# Altium schematic sheet HOST_PORT-USB2.0.SchDoc
size C
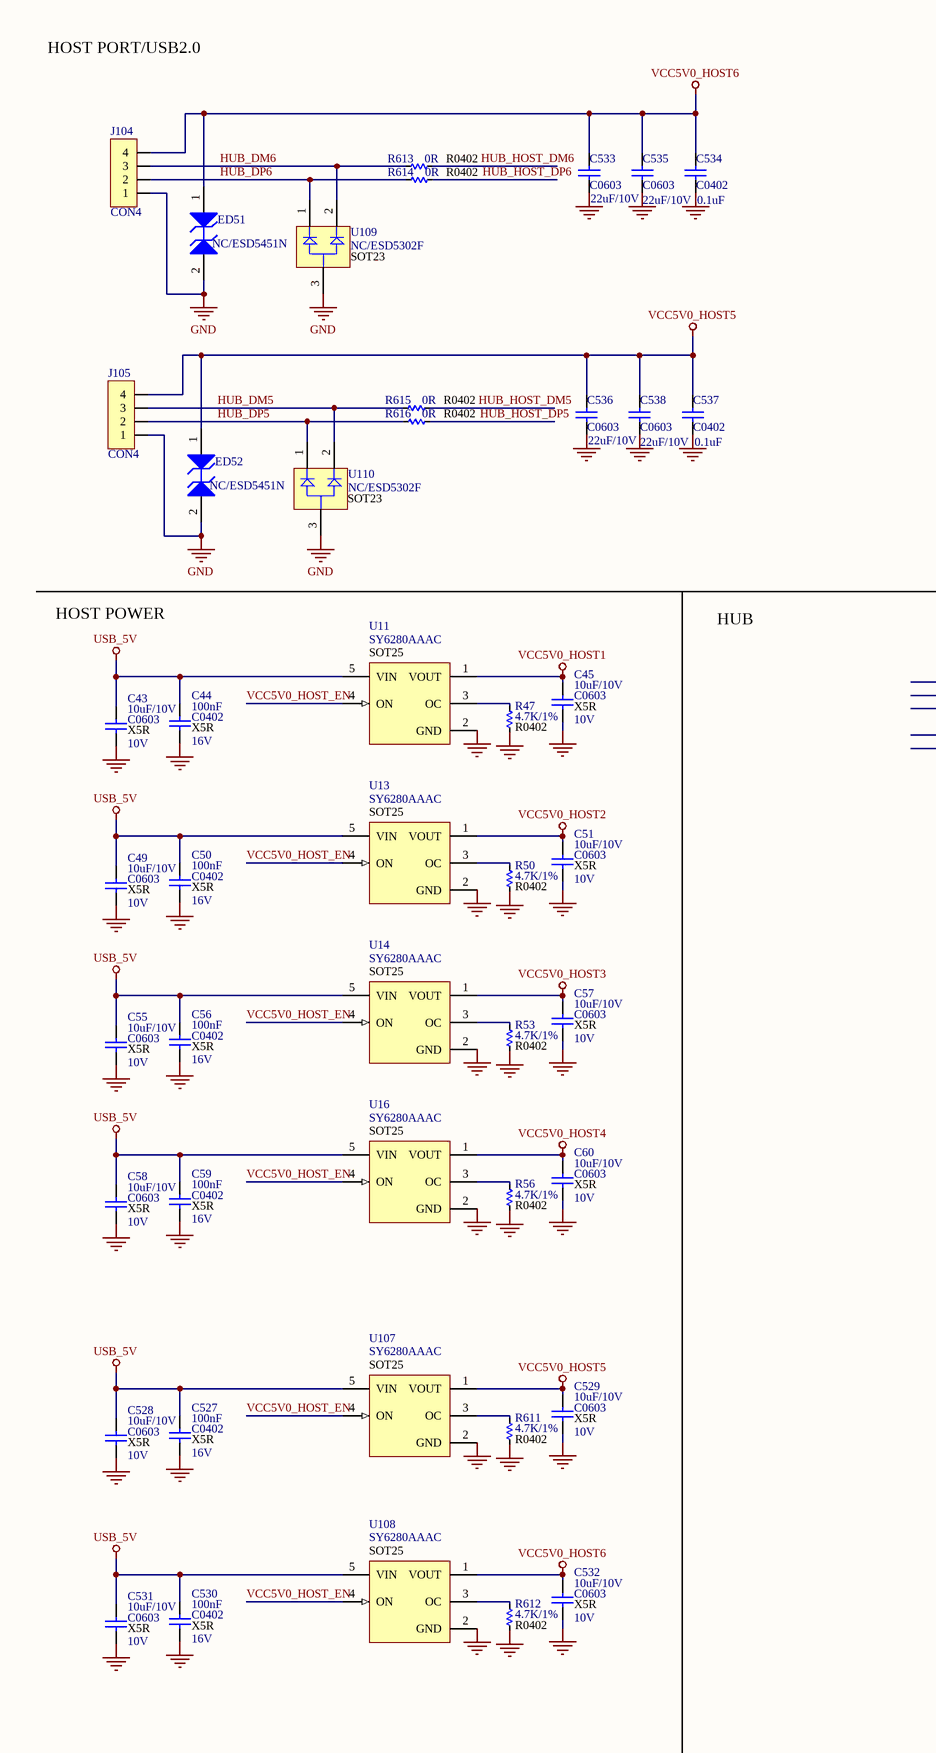
[diagram p0: HOST_PORT-USB2.0.SchDoc, left]
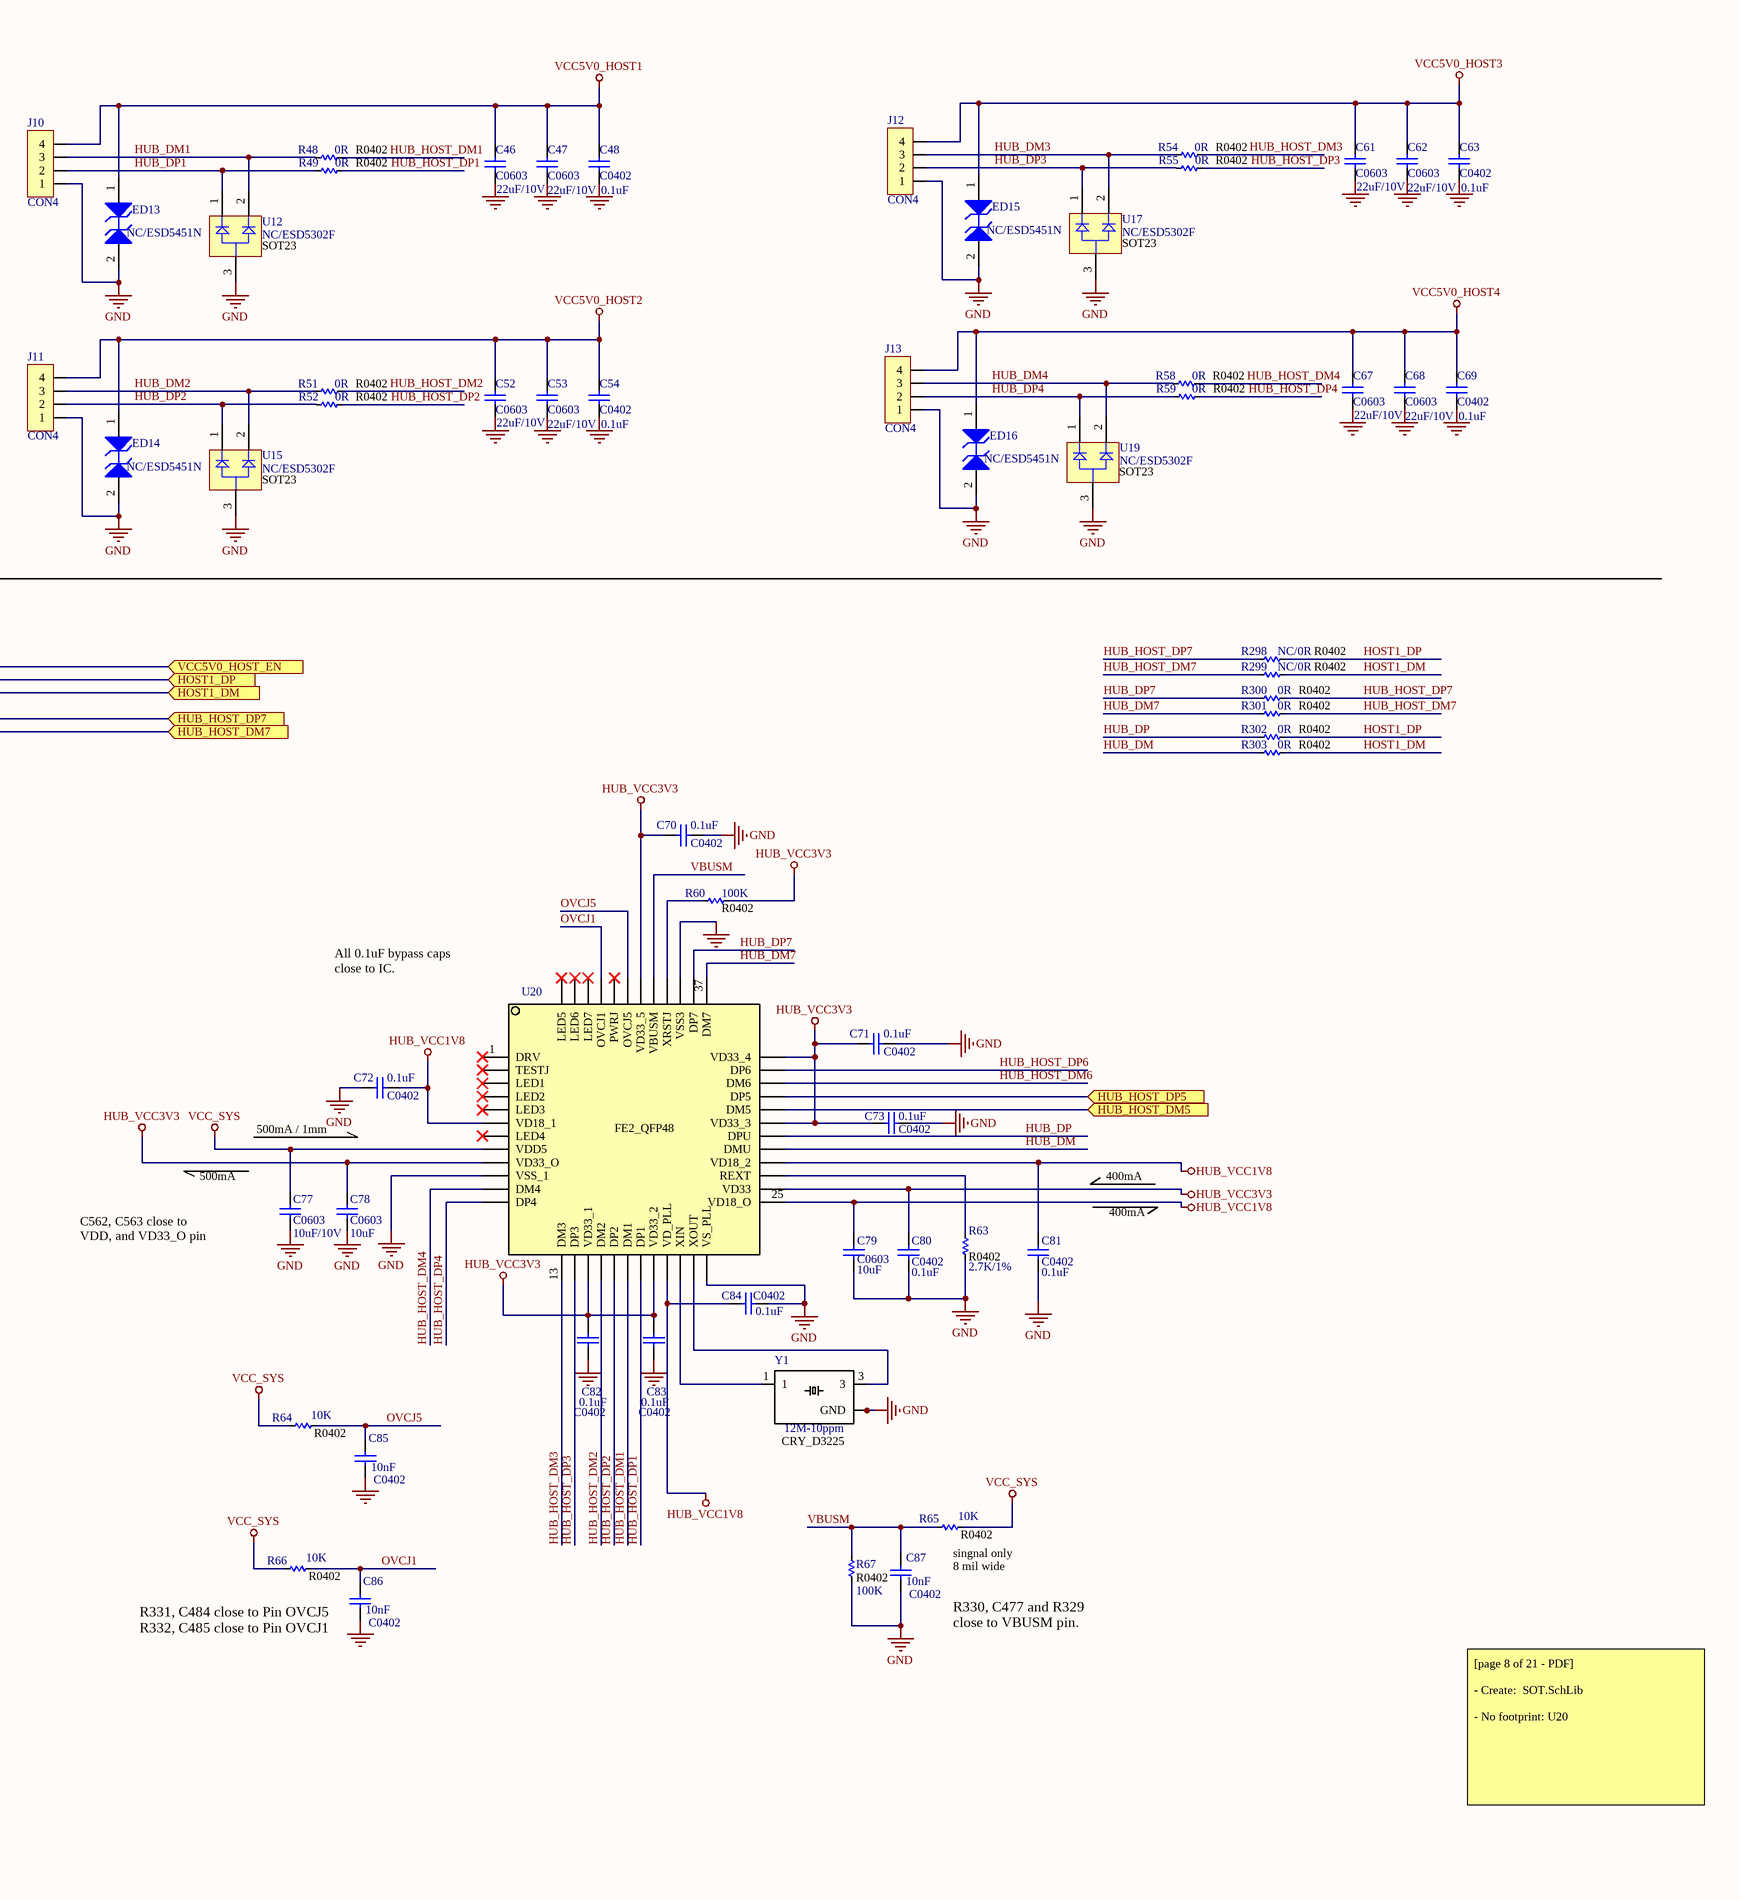
[diagram p1: HOST_PORT-USB2.0.SchDoc, right]

## Parts
C43  C0603  value 10uF/10V  [C 0603]
C44  C0402  value 100nF  [C 0402]
C45  C0603  value 10uF/10V  [C 0603]
C46  C0603  value 22uF/10V  [C 0603]
C47  C0603  value 22uF/10V  [C 0603]
C48  C0402  value 0.1uF  [C 0402]
C49  C0603  value 10uF/10V  [C 0603]
C50  C0402  value 100nF  [C 0402]
C51  C0603  value 10uF/10V  [C 0603]
C52  C0603  value 22uF/10V  [C 0603]
C53  C0603  value 22uF/10V  [C 0603]
C54  C0402  value 0.1uF  [C 0402]
C55  C0603  value 10uF/10V  [C 0603]
C56  C0402  value 100nF  [C 0402]
C57  C0603  value 10uF/10V  [C 0603]
C58  C0603  value 10uF/10V  [C 0603]
C59  C0402  value 100nF  [C 0402]
C60  C0603  value 10uF/10V  [C 0603]
C61  C0603  value 22uF/10V  [C 0603]
C62  C0603  value 22uF/10V  [C 0603]
C63  C0402  value 0.1uF  [C 0402]
C67  C0603  value 22uF/10V  [C 0603]
C68  C0603  value 22uF/10V  [C 0603]
C69  C0402  value 0.1uF  [C 0402]
C70  C0402  value 0.1uF  [C 0402]
C71  C0402  value 0.1uF  [C 0402]
C72  C0402  value 0.1uF  [C 0402]
C73  C0402  value 0.1uF  [C 0402]
C77  C0603  value 10uF/10V  [C 0603]
C78  C0603  value 10uF  [C 0603]
C79  C0603  value 10uF  [C 0603]
C80  C0402  value 0.1uF  [C 0402]
C81  C0402  value 0.1uF  [C 0402]
C82  C0402  value 0.1uF  [C 0402]
C83  C0402  value 0.1uF  [C 0402]
C84  C0402  value 0.1uF  [C 0402]
C85  C0402  value 10nF  [C 0402]
C86  C0402  value 10nF  [C 0402]
C87  C0402  value 10nF  [C 0402]
C527  C0402  value 100nF  [C 0402]
C528  C0603  value 10uF/10V  [C 0603]
C529  C0603  value 10uF/10V  [C 0603]
C530  C0402  value 100nF  [C 0402]
C531  C0603  value 10uF/10V  [C 0603]
C532  C0603  value 10uF/10V  [C 0603]
C533  C0603  value 22uF/10V  [C 0603]
C534  C0402  value 0.1uF  [C 0402]
C535  C0603  value 22uF/10V  [C 0603]
C536  C0603  value 22uF/10V  [C 0603]
C537  C0402  value 0.1uF  [C 0402]
C538  C0603  value 22uF/10V  [C 0603]
ED13  NC/ESD5451N  [DFN1006-2L]
ED14  NC/ESD5451N  [DFN1006-2L]
ED15  NC/ESD5451N  [DFN1006-2L]
ED16  NC/ESD5451N  [DFN1006-2L]
ED51  NC/ESD5451N  [DFN1006-2L]
ED52  NC/ESD5451N  [DFN1006-2L]
J10  CON4  [CON4]
J11  CON4  [CON4]
J12  CON4  [CON4]
J13  CON4  [CON4]
J104  CON4  [CON4]
J105  CON4  [CON4]
R47  R0402  value 4.7K/1%  [R 0402]
R48  R0402  value 0R  [R 0402]
R49  R0402  value 0R  [R 0402]
R50  R0402  value 4.7K/1%  [R 0402]
R51  R0402  value 0R  [R 0402]
R52  R0402  value 0R  [R 0402]
R53  R0402  value 4.7K/1%  [R 0402]
R54  R0402  value 0R  [R 0402]
R55  R0402  value 0R  [R 0402]
R56  R0402  value 4.7K/1%  [R 0402]
R58  R0402  value 0R  [R 0402]
R59  R0402  value 0R  [R 0402]
R60  R0402  value 100K  [R 0402]
R63  R0402  value 2.7K/1%  [R 0402]
R64  R0402  value 10K  [R 0402]
R65  R0402  value 10K  [R 0402]
R66  R0402  value 10K  [R 0402]
R67  R0402  value 100K  [R 0402]
R298  R0402  value NC/0R  [R 0402]
R299  R0402  value NC/0R  [R 0402]
R300  R0402  value 0R  [R 0402]
R301  R0402  value 0R  [R 0402]
R302  R0402  value 0R  [R 0402]
R303  R0402  value 0R  [R 0402]
R611  R0402  value 4.7K/1%  [R 0402]
R612  R0402  value 4.7K/1%  [R 0402]
R613  R0402  value 0R  [R 0402]
R614  R0402  value 0R  [R 0402]
R615  R0402  value 0R  [R 0402]
R616  R0402  value 0R  [R 0402]
U11  SY6280AAAC  [DCK5_N]
U12  NC/ESD5302F  PackageReference: SOT23  [INF-SOT23_N]
U13  SY6280AAAC  [DCK5_N]
U14  SY6280AAAC  [DCK5_N]
U15  NC/ESD5302F  PackageReference: SOT23  [INF-SOT23_N]
U16  SY6280AAAC  [DCK5_N]
U17  NC/ESD5302F  PackageReference: SOT23  [INF-SOT23_N]
U19  NC/ESD5302F  PackageReference: SOT23  [INF-SOT23_N]
U20  FE2_QFP48  [LQFP48_N]  (value not drawn)
U107  SY6280AAAC  [DCK5_N]
U108  SY6280AAAC  [DCK5_N]
U109  NC/ESD5302F  PackageReference: SOT23  [INF-SOT23_N]
U110  NC/ESD5302F  PackageReference: SOT23  [INF-SOT23_N]
Y1  12M-10ppm  [Crystal 4-SMD 32x25]

## Ports
HOST1_DM (in), HOST1_DP (in), HUB_HOST_DM5 (in), HUB_HOST_DM7 (in), HUB_HOST_DP5 (in), HUB_HOST_DP7 (in), VCC5V0_HOST_EN (in)

## Nets
GND: C43.2 C44.2 C45.2 C46.1 C47.1 C48.1 C49.2 C50.2 C51.2 C52.1 C53.1 C54.1 C55.2 C56.2 C57.2 C58.2 C59.2 C60.2 C61.1 C62.1 C63.1 C67.1 C68.1 C69.1 C70.1 C71.1 C72.2 C73.1 C77.2 C78.2 C79.2 C80.2 C81.2 C82.1 C83.2 C84.2 C85.2 C86.2 C87.2 C527.2 C528.2 C529.2 C530.2 C531.2 C532.2 C533.1 C534.1 C535.1 C536.1 C537.1 C538.1 ED13.2(A2) ED14.2(A2) ED15.2(A2) ED16.2(A2) ED51.2(A2) ED52.2(A2) J10.1 J11.1 J12.1 J13.1 J104.1 J105.1 R47.2 R50.2 R53.2 R56.2 R63.2 R67.1 R611.2 R612.2 U11.2(GND) U12.3(A) U13.2(GND) U14.2(GND) U15.3(A) U16.2(GND) U17.3(A) U19.3(A) U20.10(VSS_1) U20.24(VS_PLL) U20.39(VSS3) U107.2(GND) U108.2(GND) U109.3(A) U110.3(A) Y1.2(GND) Y1.4(GND)
HUB_VCC1V8: C72.1 C79.1 C81.1 C84.1 U20.6(VD18_1) U20.21(VD_PLL) U20.25(VD18_O) U20.28(VD18_2)
HUB_VCC3V3: C70.2 C71.2 C73.2 C78.1 C80.1 C82.2 C83.1 R60.1 U20.9(VD33_O) U20.15(VD33_1) U20.20(VD33_2) U20.26(VD33) U20.31(VD33_3) U20.36(VD33_4) U20.42(VD33_5)
USB_5V: C43.1 C44.1 C49.1 C50.1 C55.1 C56.1 C58.1 C59.1 C527.1 C528.1 C530.1 C531.1 U11.5(VIN) U13.5(VIN) U14.5(VIN) U16.5(VIN) U107.5(VIN) U108.5(VIN)
VCC5V0_HOST1: C45.1 C46.2 C47.2 C48.2 ED13.1(A1) J10.4 U11.1(VOUT)
VCC5V0_HOST2: C51.1 C52.2 C53.2 C54.2 ED14.1(A1) J11.4 U13.1(VOUT)
VCC5V0_HOST3: C57.1 C61.2 C62.2 C63.2 ED15.1(A1) J12.4 U14.1(VOUT)
VCC5V0_HOST4: C60.1 C67.2 C68.2 C69.2 ED16.1(A1) J13.4 U16.1(VOUT)
VCC5V0_HOST5: C529.1 C536.2 C537.2 C538.2 ED52.1(A1) J105.4 U107.1(VOUT)
VCC5V0_HOST6: C532.1 C533.2 C534.2 C535.2 ED51.1(A1) J104.4 U108.1(VOUT)
VCC_SYS: C77.1 R64.1 R65.2 R66.1 U20.8(VDD5)
HOST1_DM: R299.1 R303.1
HOST1_DP: R298.1 R302.1
HUB_DM: R303.2 U20.29(DMU)
HUB_DM1: J10.3 R48.2 U12.2(K2)
HUB_DM2: J11.3 R51.2 U15.2(K2)
HUB_DM3: J12.3 R54.2 U17.2(K2)
HUB_DM4: J13.3 R58.2 U19.2(K2)
HUB_DM5: J105.3 R615.2 U110.2(K2)
HUB_DM6: J104.3 R613.2 U109.2(K2)
HUB_DM7: R301.2 U20.37(DM7)
HUB_DP: R302.2 U20.30(DPU)
HUB_DP1: J10.2 R49.2 U12.1(K1)
HUB_DP2: J11.2 R52.2 U15.1(K1)
HUB_DP3: J12.2 R55.2 U17.1(K1)
HUB_DP4: J13.2 R59.2 U19.1(K1)
HUB_DP5: J105.2 R616.2 U110.1(K1)
HUB_DP6: J104.2 R614.2 U109.1(K1)
HUB_DP7: R300.2 U20.38(DP7)
HUB_HOST_DM1: R48.1 U20.18(DM1)
HUB_HOST_DM2: R51.1 U20.16(DM2)
HUB_HOST_DM3: R54.1 U20.13(DM3)
HUB_HOST_DM4: R58.1 U20.11(DM4)
HUB_HOST_DM5: R615.1
HUB_HOST_DM5: U20.32(DM5) ; port HUB_HOST_DM5  [a separate net that carries the same name]
HUB_HOST_DM6: R613.1 U20.34(DM6)
HUB_HOST_DM7: R299.2 R301.1
HUB_HOST_DP1: R49.1 U20.19(DP1)
HUB_HOST_DP2: R52.1 U20.17(DP2)
HUB_HOST_DP3: R55.1 U20.14(DP3)
HUB_HOST_DP4: R59.1 U20.12(DP4)
HUB_HOST_DP5: R616.1
HUB_HOST_DP5: U20.33(DP5) ; port HUB_HOST_DP5  [a separate net that carries the same name]
HUB_HOST_DP6: R614.1 U20.35(DP6)
HUB_HOST_DP7: R298.2 R300.1
OVCJ1: C86.1 R66.2 U20.45(OVCJ1)
OVCJ5: C85.1 R64.2 U20.43(OVCJ5)
VBUSM: C87.1 R65.1 R67.2 U20.41(VBUSM)
VCC5V0_HOST_EN: U11.4(ON) U13.4(ON) U14.4(ON) U16.4(ON) U107.4(ON) U108.4(ON)
NetR47_1: R47.1 U11.3(OC)
NetR50_1: R50.1 U13.3(OC)
NetR53_1: R53.1 U14.3(OC)
NetR56_1: R56.1 U16.3(OC)
NetR60_2: R60.2 U20.40(XRSTJ)
NetR63_1: R63.1 U20.27(REXT)
NetR611_1: R611.1 U107.3(OC)
NetR612_1: R612.1 U108.3(OC)
NetU20_22: U20.22(XIN) Y1.1
NetU20_23: U20.23(XOUT) Y1.3

Not connected (* = marked no-connect by the designer): U20 1(DRV)* 2(TESTJ)* 3(LED1)* 4(LED2)* 5(LED3)* 7(LED4)* 44(PWRJ)* 46(LED7)* 47(LED6)* 48(LED5)*

## Notes on the sheet
- HOST PORT/USB2.0
- HOST POWER
- HUB
- All 0.1uF bypass caps close to IC.
- 500mA
- 500mA / 1mm
- 400mA
- C562, C563 close to VDD, and VD33_O pin
- (near R65) singnal only 8 mil wide
- R331, C484 close to Pin OVCJ5
  R332, C485 close to Pin OVCJ1
- R330, C477 and R329 close to VBUSM pin.
- [page 8 of 21 - PDF]
  - Create:  SOT.SchLib
  - No footprint: U20
- (in symbol ABM8-30.000MHZ-10-1-U-T) CRY_D3225
- (in symbol Cap) X5R; 16V; 10V
- (in symbol TPS22943DCKR) SOT25

## Library data of the parts
C43-C63 C67-C73 C77-C87 C527-C538 = Cap: Capacitor; Published: 8-Jun-2000; LatestRevisionDate: 17-Jul-2002; LatestRevisionNote: Re-released for DXP Platform.; PackageReference: RAD-0.3; Publisher: Altium Limited; PackageDescription: Radial Cap, Thru-Hole; 2 Leads; 0.3 in Pin Spacing
ED13-ED16 ED51 ED52 = 1SMB54CAT3: 600 W Peak Power Zener Transient Voltage Suppressor, Bidirectional, 2-Pin SMB, Tape and Reel; Manufacturer: On Semiconductor; IR Max (uA): 5; PPK Max (W): 600; V(BR) Typ (V): 63.16; DatasheetVersion: Rev. A; PackageVersion: Rev. A, 01/2000; PackageReference: SMB-2-403C-01; PackageDescription: 2-Pin Small Molded Package, J-Bend Lead, Body 4.315 x 3.555 mm; Supplier 1: Digi-Key; Supplier Part Number 1: 1SMB54CAT3-ND; Direction: Bidirectional; Packing: Tape and Reel; Mounting Technology: Surface Mount; PartNumber: 1SMB54CAT3; ComponentLink1Description: Manufacturer URL; ComponentLink1URL: http://www.onsemi.com/; ComponentLink2Description: Datasheet; ComponentLink2URL: http://www.onsemi.com/pub_link/Collateral/1SMB10CAT3-D.PDF; ComponentLink3Description: Package Specification; ComponentLink3URL: http://www.onsemi.com/pub_link/Collateral/1SMB10CAT3-D.PDF
J10-J13 J104 J105 = JP4: WR-PHD 2.54 mm Angled Socket Header; Manufacturer: W¨¹rth Elektronik eiSos GmbH; partNo: 613004143121; ComponentLink1 Description: Manufacturer; ComponentLink2 Description: Datasheet; NoPins: 04; Created Date: 29 March 2013; ComponentLink1URL: http://www.we-online.com; ComponentLink2URL: http://katalog.we-online.de/em/datasheet/6130xx143121.pdf; Created by: Karrer Zheng
R47-R56 R58-R60 R63-R67 R298-R303 R611-R616 = Res-SMD: Resistor; Manufacturer: Generic Components; Class: Passive; Published: 08/06/2000; Publisher: Altium Hobart Technology Centre
U11 U13 U14 U16 U107 U108 = TPS22943DCKR: Low-Input Voltage 40 mA Current Limited Load Switch, 400 mOhms rDS(On), -40 to 85 degC, 5-pin SC70 (DCK), Green (RoHS & no Sb/Br); Manufacturer: Texas Instruments; Adjustable Current Limit(Min)(A): 0.04; Enable/Shutdown: Active High; Iq(Typ)(uA): 40; Number of FETs: 1; rDS(on) per FET(Typ)(mOhms): 400; SubFamily: Current Limited Switch; Vin(Max)(V): 5.5; Vin(Min)(V): 1.62; DatasheetVersion: SLVS832C; PackageVersion: revG, Jan-2007; PackageReference: DCK5; PackageDescription: 5-Pin Plastic Small-Outline Package, 2 x 1.3 mm Body, 0.65 mm Pitch, 2.1 mm Lead Span; Supplier 1: Digi-Key; Supplier Part Number 1: 296-25316-2-ND; Supplier 2: Digi-Key; Supplier Part Number 2: 296-25316-1-ND; Supplier 3: Digi-Key; Supplier Part Number 3: 296-25316-6-ND; Supplier 4: Farnell; Supplier Part Number 4: 1782839; Supplier 5: Newark; Supplier Part Number 5: 51R1165; Supplier 6: Mouser; Supplier Part Number 6: 595-TPS22943DCKR; Eco-Plan: Green (RoHS & no Sb/Br); Mounting Technology: Surface Mount; Code_JEDEC: MO-203-AA; PartNumber: TPS22943DCKR; ComponentLink1Description: Datasheet; ComponentLink1URL: http://www.ti.com/general/docs/lit/getliterature.tsp?genericPartNumber=TPS22943&fileType=pdf
U12 U15 U17 U19 U109 U110 = BAT64-06: Silicon Schottky Diode, SOT23, Reel, Green; Manufacturer: Infineon; Configuration: Dual; CT (max): 6 pF; Green: TRUE; IF (max): 250 mA; VF (max): 750 mV; VR (max): 40 V; PackageVersion: Apr-08; PackageDescription: 3-Pin Small Outline Transistor Package, 1.3 x 2.9 mm Body, 0.95 mm Pitch; Supplier 1: Mouser; Supplier Part Number 1: N/A; Packing: Reel; Mounting Technology: Surface Mount; PartNumber: BAT64-06; ComponentLink1Description: Manufacturer URL; ComponentLink1URL: http://www.infineon.com/; ComponentLink2Description: Datasheet; ComponentLink2URL: http://www.infineon.com/dgdl/bat64series.pdf?folderId=db3a30431400ef68011425f1ca2505e3&fileId=db3a304314dca3890115191757980ead; ComponentLink3Description: Package Specification; ComponentLink3URL: http://www.infineon.com/dgdl/SOT23-Package_Overview.pdf?folderId=db3a30431936bc4b0119532290053c66&fileId=db3a30431936bc4b0119533468123c85
Y1 = ABM8-30.000MHZ-10-1-U-T: Ultra Miniature Crystal, SMD Ceramic, 30.000MHZ, 10pF, 10ppm@25C, 10ppm -10+60C,; MF: Abracon; SnapEDA_Link: https://www.snapeda.com/parts/ABM8-30.000MHZ-10-1-U-T/Abracon%20LLC/view-part/?ref=snap; MP: ABM8-30.000MHZ-10-1-U-T; Availability: Unavailable; Price: None; Package: SMD-4 Abracon; Value: *